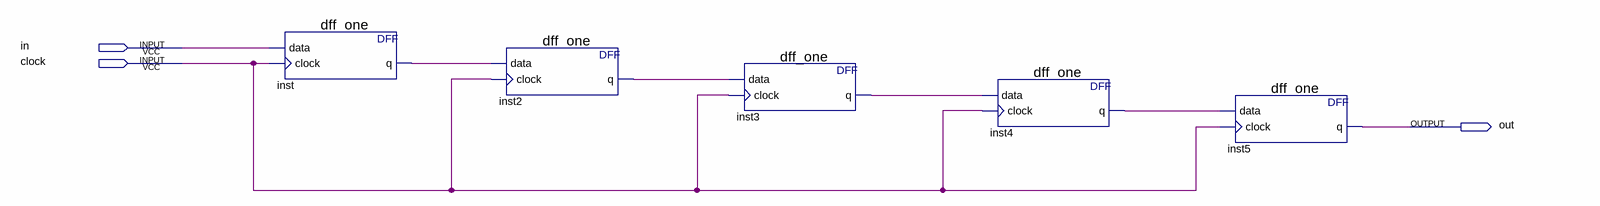
[diagram p0: schematic sheet]
// Quartus schematic rena_dff5.bdf as structural Verilog: 5 symbols, 3 pins
module rena_dff5 (
  input  in,
  input  clock,
  output out
);

  wire inst2_q, inst3_q, inst4_q, inst_q;

  dff_one inst (.data(in), .clock(clock), .q(inst_q));
  dff_one inst2 (.data(inst_q), .clock(clock), .q(inst2_q));
  dff_one inst3 (.data(inst2_q), .clock(clock), .q(inst3_q));
  dff_one inst4 (.data(inst3_q), .clock(clock), .q(inst4_q));
  dff_one inst5 (.data(inst4_q), .clock(clock), .q(out));
endmodule
